# EAGLE schematic LM2596 (EAGLE 7.5.0)
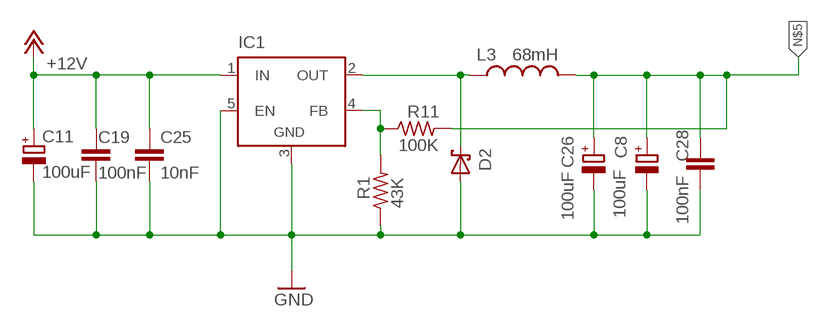
[diagram p0: schematic, sheet 1]

## Parts
C8  100uF  CPOL-EUE2.5-7  [E2,5-7]
C11  100uF  CPOL-EUE2.5-7  [E2,5-7]
C19  100nF  C-EU050-024X044  [C050-024X044]
C25  10nF  C-EU050-024X044  [C050-024X044]
C26  100uF  CPOL-EUE2.5-7  [E2,5-7]
C28  100nF  C-EU050-024X044  [C050-024X044]
D2  SCHOTTKY-DIODEDO41  [DO41-10]
IC1  LM2596TH  [TO220-52]
L3  68mH  L-US0207/10  [0207/10]
R1  43K  R-US_0204/7  [0204/7]
R11  100K  R-US_0204/7  [0204/7]

## Nets
+12V: C11.+ C19.1 C25.1 IC1.1(IN)
GND: C8.- C11.- C19.2 C25.2 C26.- C28.2 D2.A IC1.3(GND) IC1.5(EN) R1.1
N$5: C8.+ C26.+ C28.1 L3.2 R11.2
N$6: D2.C IC1.2(OUT) L3.1
N$7: IC1.4(FB) R1.2 R11.1

## Library data of the parts
C8 C11 C26 = resistor:CPOL-EU: POLARIZED CAPACITOR, European symbol
C19 C25 C28 = resistor:C-EU: CAPACITOR, European symbol
D2 = adafruit:SCHOTTKY-DIODE: Schottky Diode
IC1 = linear:LM2596T: STEP-DOWN VOLTAGE REGULATOR
L3 = rcl:L-US: INDUCTOR, American symbol
R1 R11 = adafruit:R-US_: RESISTOR, American symbol